# EAGLE design Recuperaçao e Paraquedas (EAGLE 9.6.2)

## Sheet 1 of 4: Microcontrolador recuperação
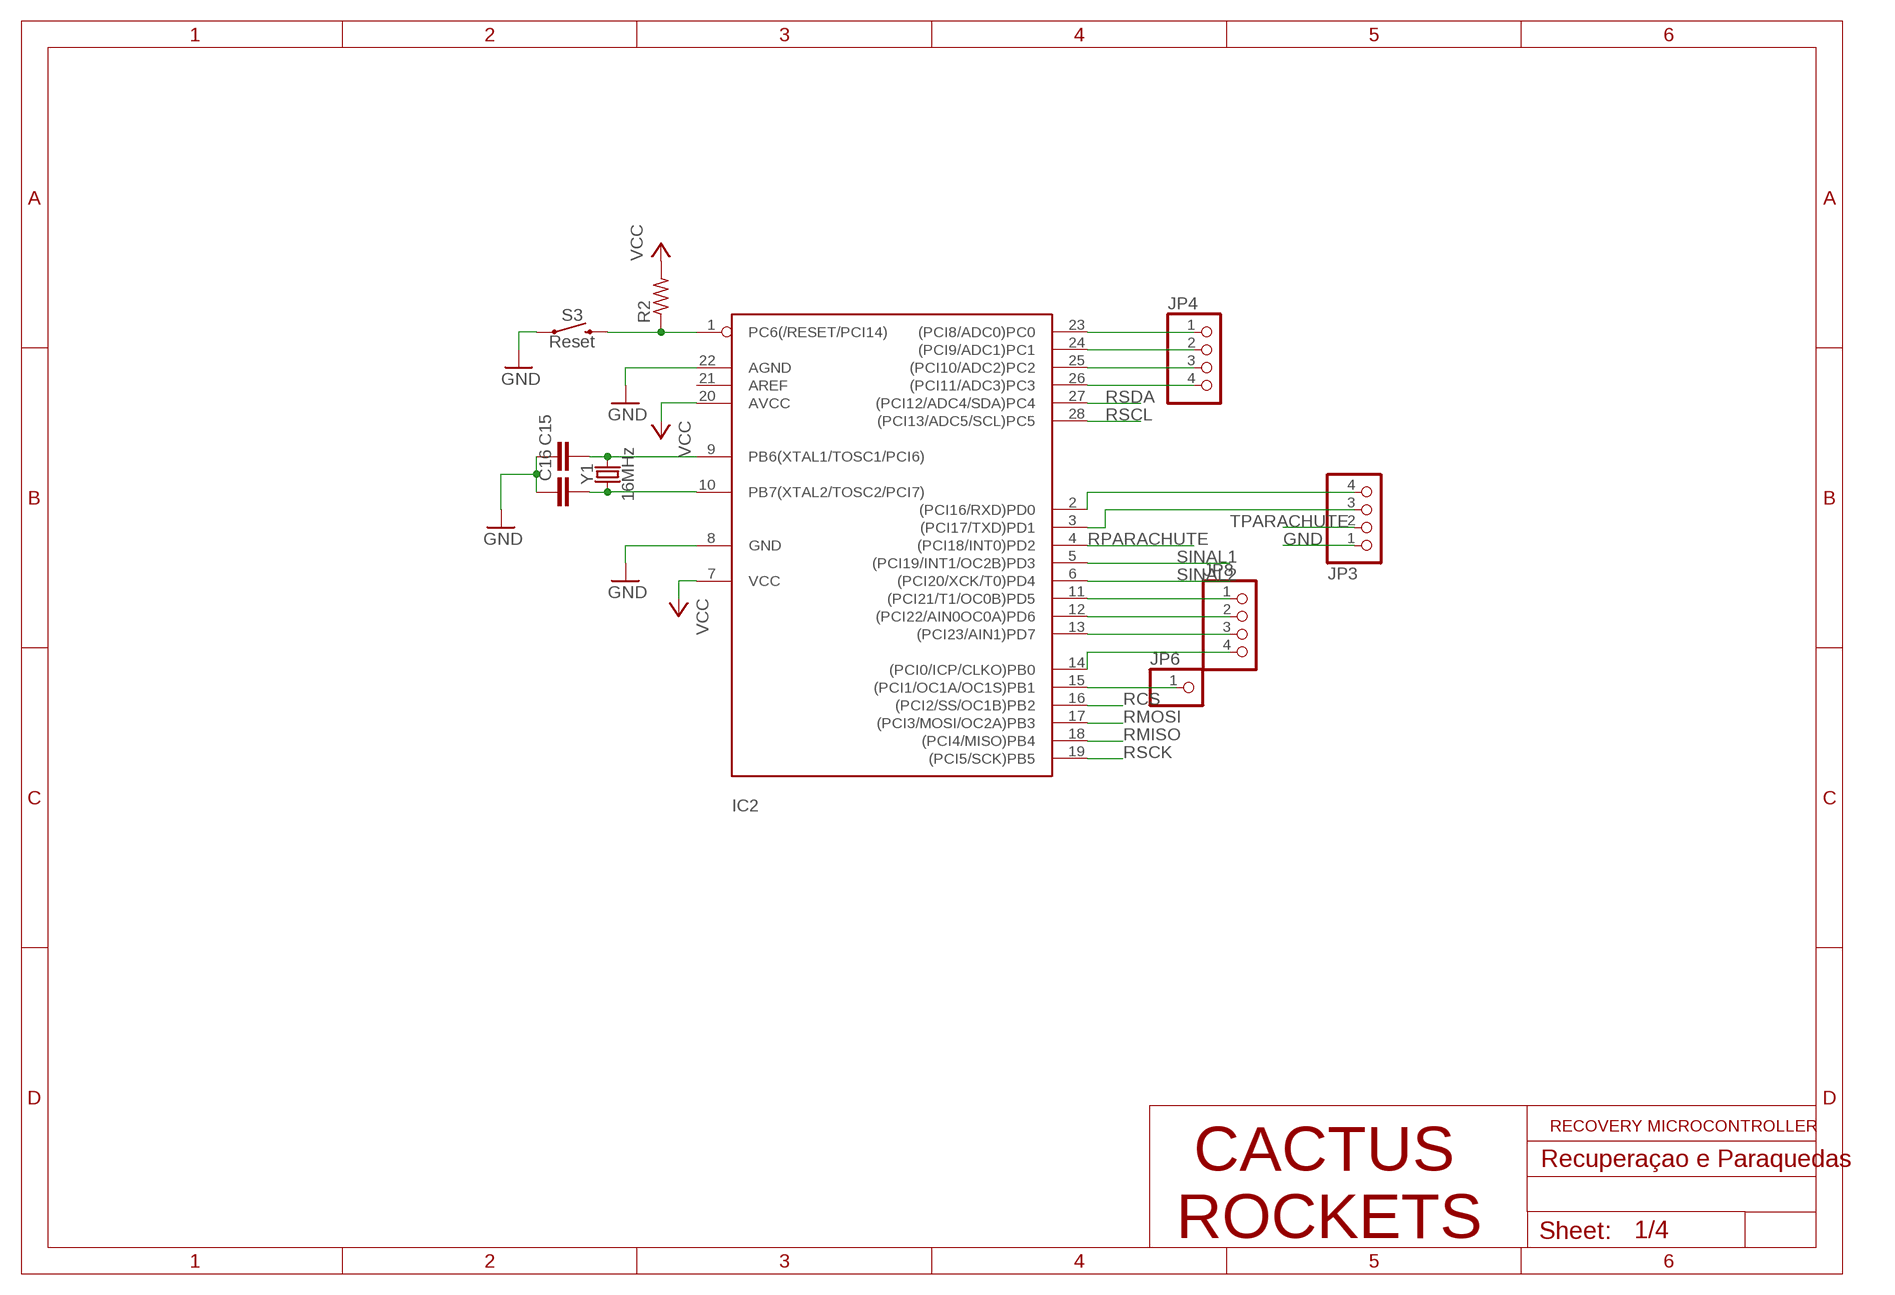
[diagram p0: schematic, sheet 1]

### Parts
C15  C-EU025-025X050  [C025-025X050]
C16  C-EU025-025X050  [C025-025X050]
IC2  ATMEGA328-20P  [DIL28-3]
JP3  PINHD-1X4/90  [1X04/90]
JP4  PINHD-1X4  [1X04]
JP6  PINHD-1X1  [1X01]
JP8  PINHD-1X4  [1X04]
R2  R-US_0207/10  [0207/10]
S3  Reset  MOMENTARY-SWITCH-SPST-PTH-6.0MM  [TACTILE_SWITCH_PTH_6.0MM]
Y1  16MHz  CRYSTAL-16MHZPTH-HC49US  [HC49US]

### Nets
GND: C15.1 C16.1 IC2.8(GND) IC2.22(AGND) JP3.1 S3.1 S3.2 ; also sheet 2,3,4
N$1: IC2.23((PCI8/ADC0)PC0) JP4.1
N$2: IC2.24((PCI9/ADC1)PC1) JP4.2
N$3: IC2.25((PCI10/ADC2)PC2) JP4.3
N$4: IC2.26((PCI11/ADC3)PC3) JP4.4
N$5: IC2.2((PCI16/RXD)PD0) JP3.4
N$8: IC2.11((PCI21/T1/OC0B)PD5) JP8.1
N$9: IC2.12((PCI22/AIN0OC0A)PD6) JP8.2
N$10: IC2.13((PCI23/AIN1)PD7) JP8.3
N$11: IC2.15((PCI1/OC1A/OC1S)PB1) JP6.1
N$12: IC2.14((PCI0/ICP/CLKO)PB0) JP8.4
N$13: C16.2 IC2.10(PB7(XTAL2/TOSC2/PCI7)) Y1.1
N$14: C15.2 IC2.9(PB6(XTAL1/TOSC1/PCI6)) Y1.2
N$15: IC2.3((PCI17/TXD)PD1) JP3.3
RCS: IC2.16((PCI2/SS/OC1B)PB2) ; also sheet 3
RESET: IC2.1(PC6(/RESET/PCI14)) R2.1 S3.3 S3.4
RMISO: IC2.18((PCI4/MISO)PB4) ; also sheet 3
RMOSI: IC2.17((PCI3/MOSI/OC2A)PB3) ; also sheet 3
RPARACHUTE: IC2.4((PCI18/INT0)PD2) ; also sheet 4
RSCK: IC2.19((PCI5/SCK)PB5) ; also sheet 3
RSCL: IC2.28((PCI13/ADC5/SCL)PC5) ; also sheet 2
RSDA: IC2.27((PCI12/ADC4/SDA)PC4) ; also sheet 2
SINAL1: IC2.5((PCI19/INT1/OC2B)PD3) ; also sheet 4
SINAL2: IC2.6((PCI20/XCK/T0)PD4) ; also sheet 4
TPARACHUTE: JP3.2 ; also sheet 4
VCC: IC2.7(VCC) IC2.20(AVCC) R2.2 ; also sheet 2,3,4
Unconnected: IC2.21(AREF)

### Notes on the sheet
- RECOVERY MICROCONTROLLER
- CACTUS
  ROCKETS

## Sheet 2 of 4: MPU-6050
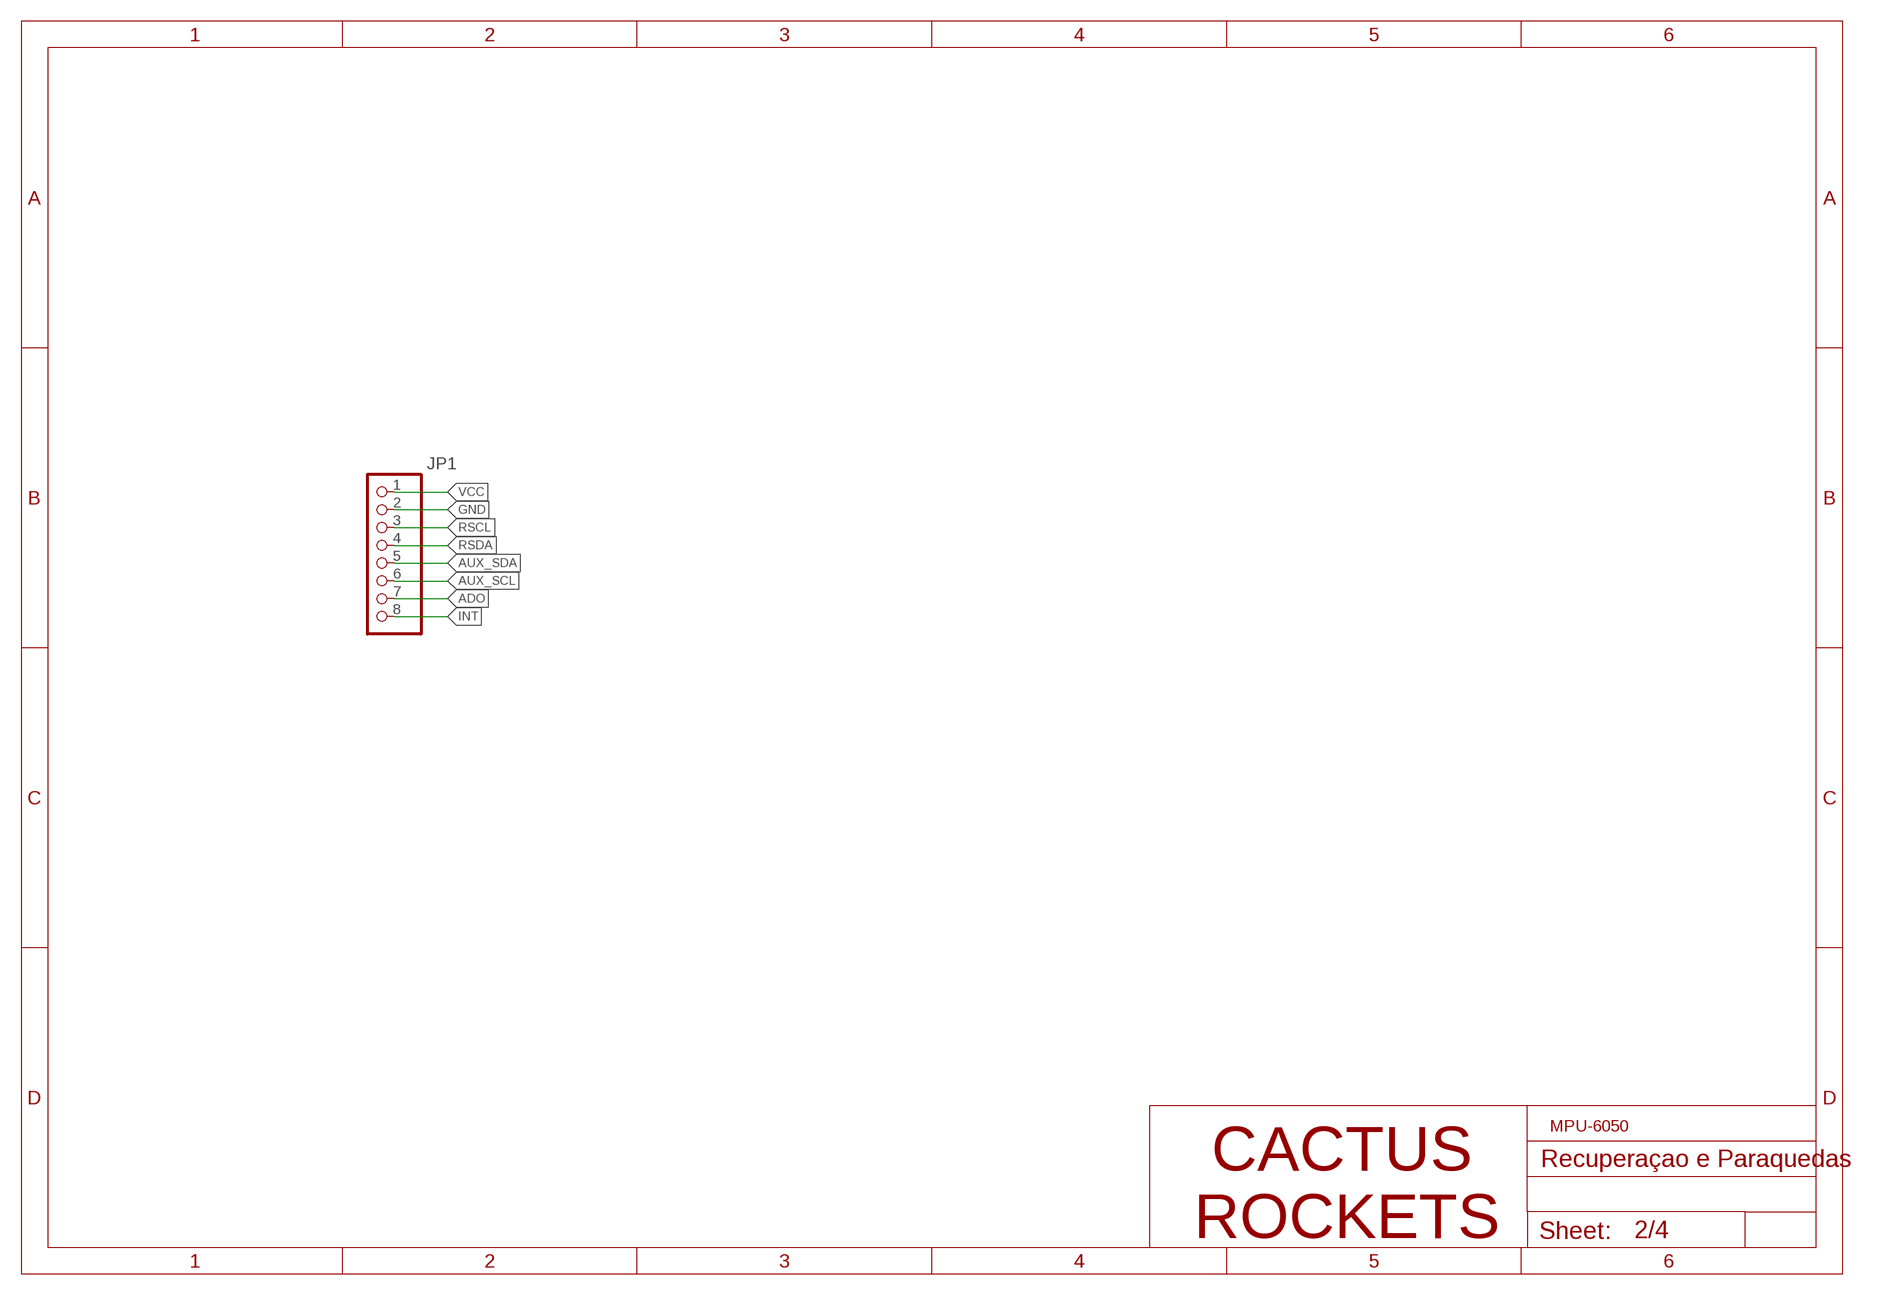
[diagram p1: schematic, sheet 2]

### Parts
JP1  PINHD-1X8  [1X08]

### Nets
ADO: JP1.7
AUX_SCL: JP1.6
AUX_SDA: JP1.5
GND: JP1.2 ; also sheet 1,3,4
INT: JP1.8
RSCL: JP1.3 ; also sheet 1
RSDA: JP1.4 ; also sheet 1
VCC: JP1.1 ; also sheet 1,3,4

### Notes on the sheet
- MPU-6050
- CACTUS
  ROCKETS

## Sheet 3 of 4: BMP280
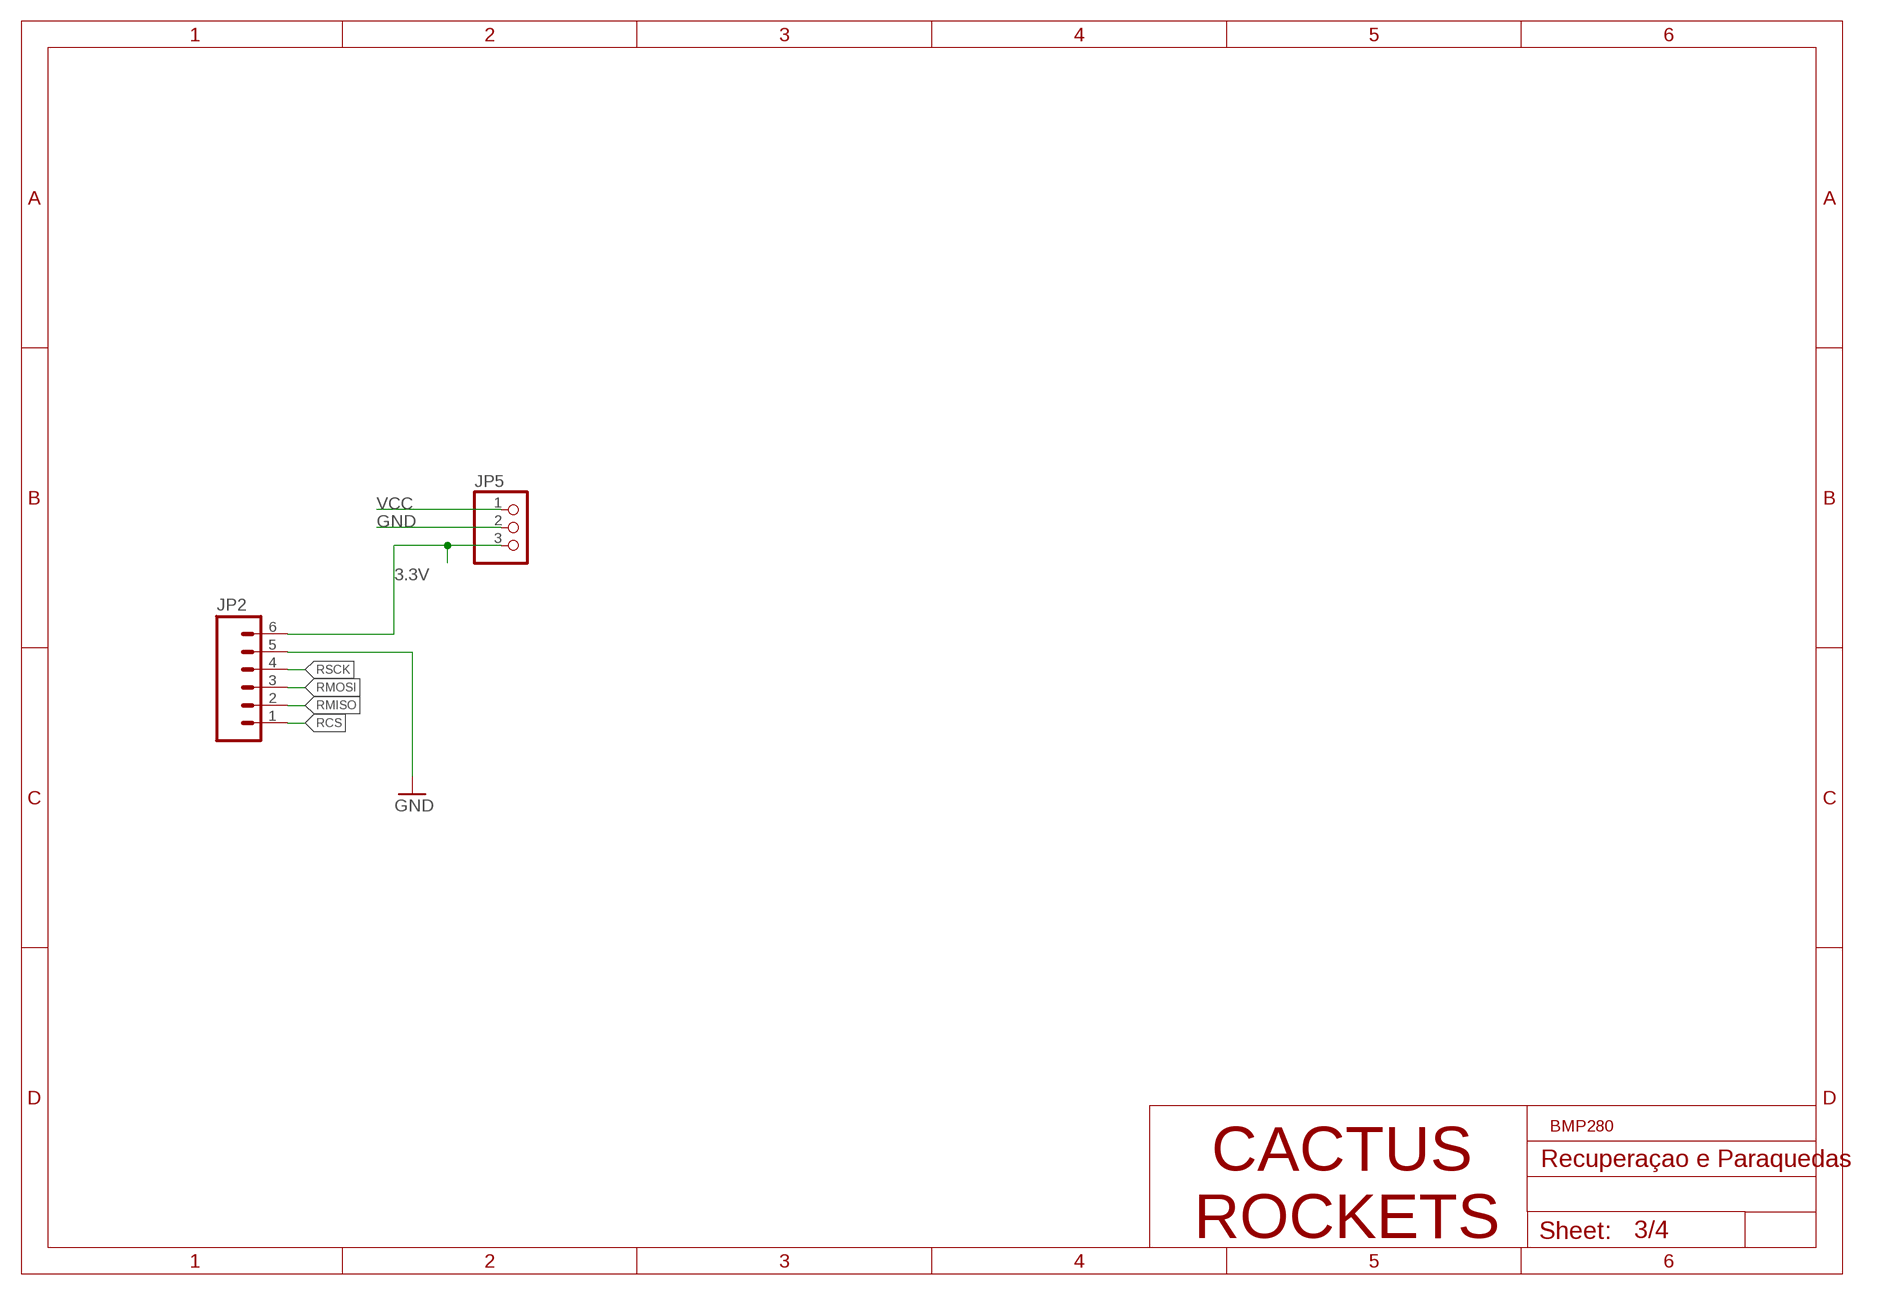
[diagram p2: schematic, sheet 3]

### Parts
JP2  M06NO_SILK_FEMALE_PTH  [1X06_NO_SILK]
JP5  PINHD-1X3/90  [1X03/90]

### Nets
3.3V: JP2.6 JP5.3
GND: JP2.5 JP5.2 ; also sheet 1,2,4
RCS: JP2.1 ; also sheet 1
RMISO: JP2.2 ; also sheet 1
RMOSI: JP2.3 ; also sheet 1
RSCK: JP2.4 ; also sheet 1
VCC: JP5.1 ; also sheet 1,2,4

### Notes on the sheet
- BMP280
- CACTUS
  ROCKETS

## Sheet 4 of 4
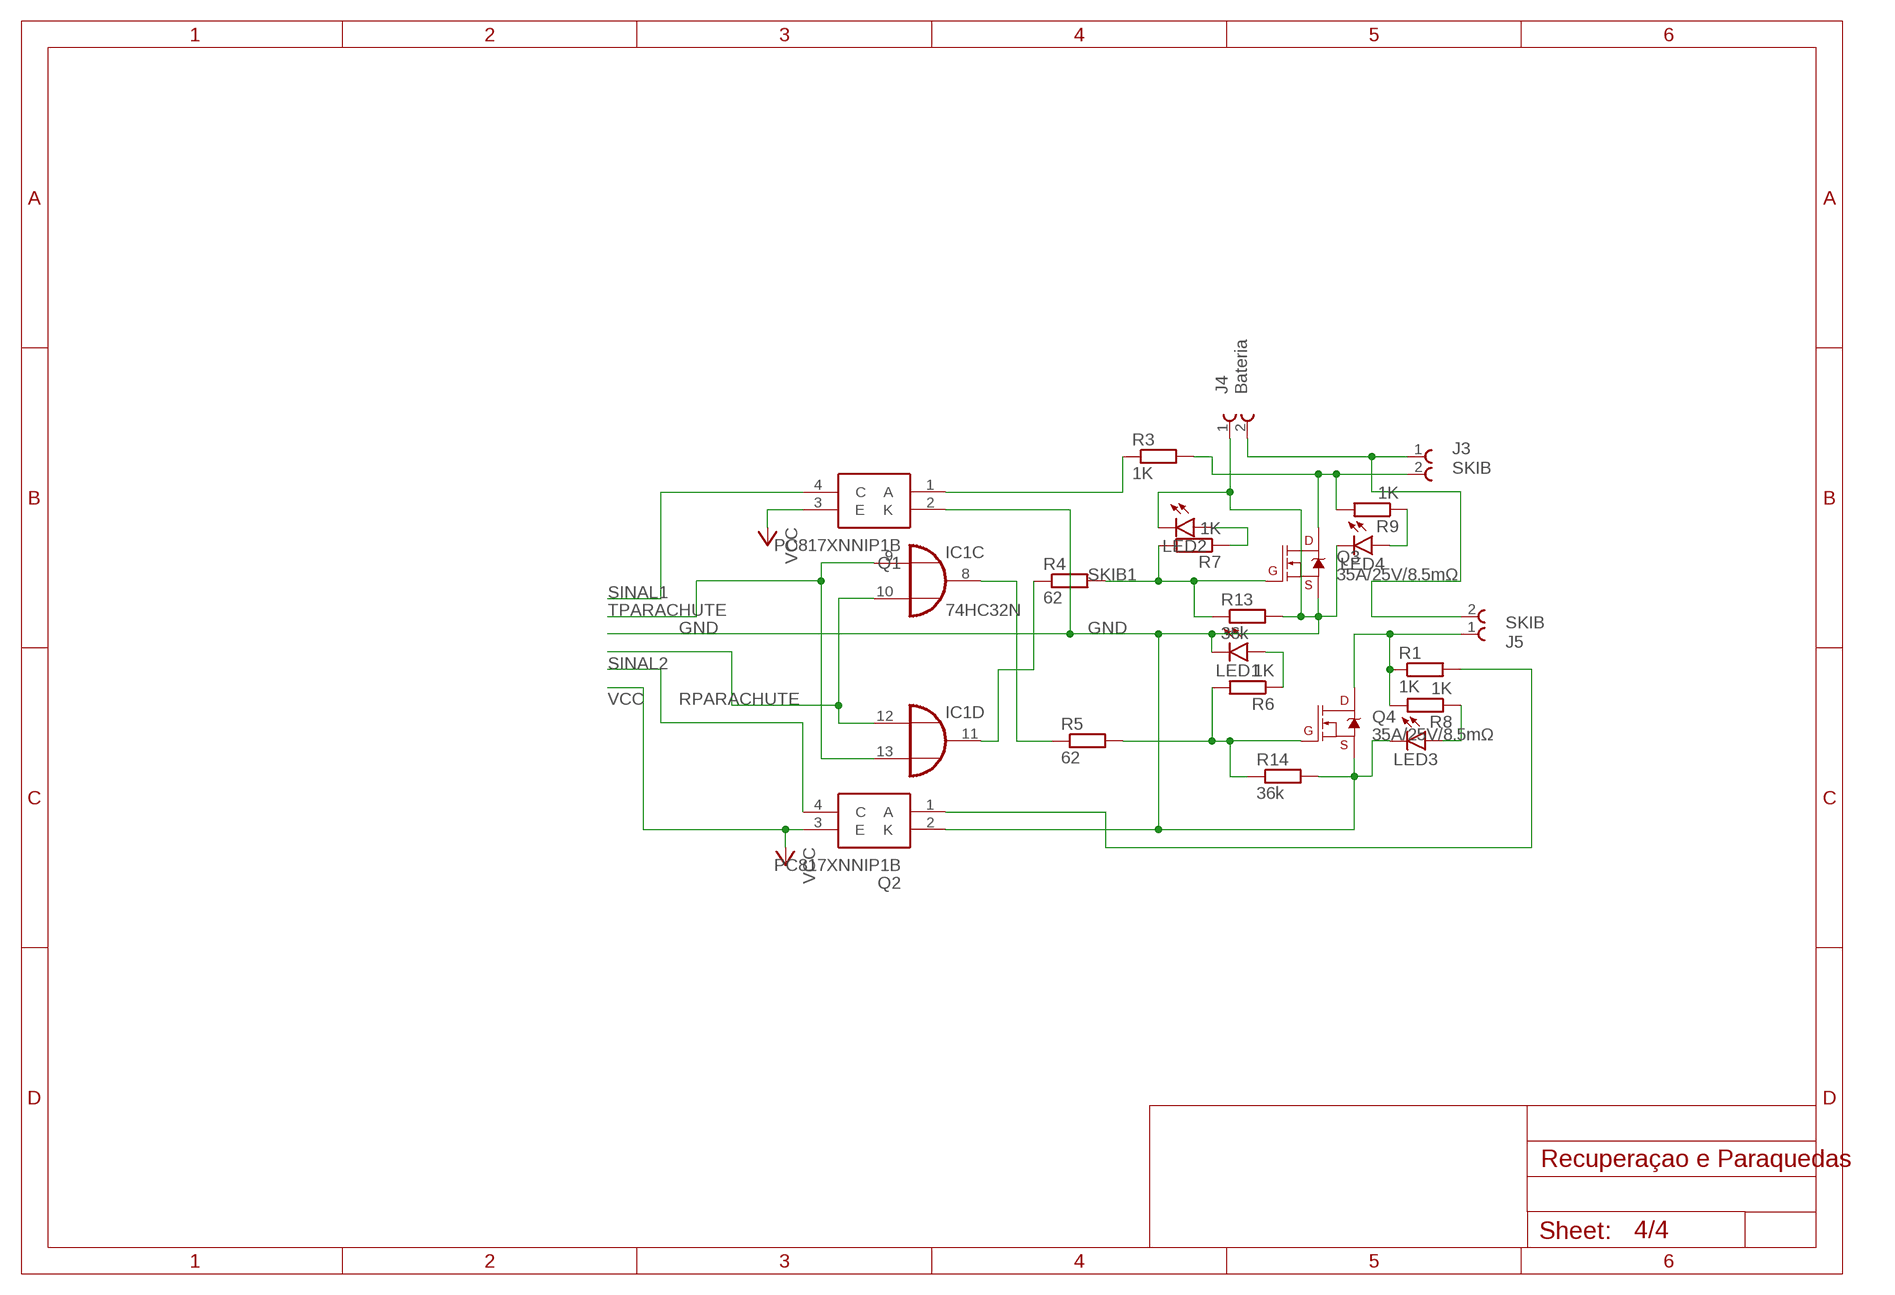
[diagram p3: schematic, sheet 4]

### Parts
IC1  74HC32N  [DIL14]
J3  SKIB  691111710002  [691111710002]
J4  Bateria  691111710002  [691111710002]
J5  SKIB  691111710002  [691111710002]
LED1  LEDCHIP-LED0805  [CHIP-LED0805]
LED2  LEDCHIP-LED0805  [CHIP-LED0805]
LED3  LEDCHIP-LED0805  [CHIP-LED0805]
LED4  LEDCHIP-LED0805  [CHIP-LED0805]
Q1  PC817XNNIP1B  [SOP254P960X420-4N]
Q2  PC817XNNIP1B  [SOP254P960X420-4N]
Q3  35A/25V/8.5mΩ  MOSFET-NCH-FDD8780  [TO-252/DPAK]
Q4  35A/25V/8.5mΩ  MOSFET-NCH-FDD8780  [TO-252/DPAK]
R1  1K  R-EU_R0603  [R0603]
R3  1K  R-EU_R0603  [R0603]
R4  62  R-EU_M0805  [M0805]
R5  62  R-EU_M0805  [M0805]
R6  1K  R-EU_M0805  [M0805]
R7  1K  R-EU_M0805  [M0805]
R8  1K  R-EU_M0805  [M0805]
R9  1K  R-EU_M0805  [M0805]
R13  36k  R-EU_M0805  [M0805]
R14  36k  R-EU_M0805  [M0805]

### Nets
GND: J4.1 LED1.C LED2.C LED3.C LED4.C Q1.2(K) Q2.2(K) Q3.3(S) Q4.3(S) R13.2 R14.2 ; also sheet 1,2,3
N$6: IC1.8(C:O) R5.1
N$7: IC1.11(D:O) R4.1
N$17: Q1.1(A) R3.1
N$19: LED4.A R9.1
N$20: Q2.1(A) R1.2
N$21: J3.1 J4.2 J5.2
N$22: LED2.A R7.1
N$23: LED1.A R6.1
N$24: LED3.A R8.1
N$25: J5.1 Q4.2(D) R1.1 R8.2
N$29: J3.2 Q3.2(D) R3.2 R9.2
RPARACHUTE: IC1.10(C:I1) IC1.12(D:I0) ; also sheet 1
SINAL1: Q1.4(C) ; also sheet 1
SINAL2: Q2.4(C) ; also sheet 1
SKIB1: Q3.1(G) R4.2 R7.2 R13.1
SKIB2: Q4.1(G) R5.2 R6.2 R14.1
TPARACHUTE: IC1.9(C:I0) IC1.13(D:I1) ; also sheet 1
VCC: Q1.3(E) Q2.3(E) ; also sheet 1,2,3
Unconnected: IC1.1(A:I0) IC1.2(A:I1) IC1.3(A:O) IC1.4(B:I0) IC1.5(B:I1) IC1.6(B:O)

## Power pins joined to a net without a drawn wire
GND: IC1.7(P:GND)
VCC: IC1.14(P:VCC)

## Library data of the parts
C15 C16 = rcl:C-EU: CAPACITOR, European symbol; SPICEPREFIX: C
IC1 = 74xx-eu:74*32: Quad 2-input OR gate
IC2 = atmega328:ATMEGA328*P: MICROCONTROLLER 32 kBytes FLASH 2 kBytes SRAM 1 kBytes EEPROM USART 8-channel 10 bit ADC
J3-J5 = 691111710002:691111710002: WR-TBL Serie 111 - 5.0mm Horizontal Entry Modular With Pressure Clamp - 2.0mm2 Wires, 2 Pins=>Code : Con_TBL_Screw_PressureClamp_691111710002 <http://katalog.we-online.de/media/images/eican/Con_TBL_Screw_PressureClamp_6911117100xx_pf2.jpg> Details see: http://katalog.we-online.de/en/em/691_111_710_0xx Created 2014-06-17, Karrer Zheng 2014 (C) Würth Elektronik Check availability <https://pricing.snapeda.com/parts/691111710002/Wurth%20Electronics/view-part?ref=eda>; AVAILABILITY: In Stock; DESCRIPTION: 2 Position Wire to Board Terminal Block Horizontal with Board 0.197 (5.00mm) Through Hole; MF: Wurth Electronics; MP: 691111710002; PACKAGE: None; PRICE: None; PURCHASE-URL: https://pricing.snapeda.com/search/part/691111710002/?ref=eda
JP1 = pinhead:PINHD-1X8: PIN HEADER
JP2 = SparkFun-Connectors:M06: Header 6 Standard 6-pin 0.1" header. Use with straight break away headers (SKU : PRT-00116), right angle break away headers (PRT-00553), swiss pins (PRT-00743), machine pins (PRT-00117), and female headers (PRT-00115). Molex polarized connector foot print use with SKU : PRT-08094 with associated crimp pins and housings. NOTES ON THE VARIANTS LOCK and LOCK_LONGPADS... This footprint was designed to help hold the alignment of a through-hole component (i.e. 6-pin header) while soldering it into place. You may notice that each hole has been shifted either up or down by 0.005 of an inch from it's more standard position (which is a perfectly straight line). This slight alteration caused the pins (the squares in the middle) to touch the edges of the holes. Because they are alternating, it causes a "brace" to hold the component in place. 0.005 has proven to be the perfect amount of "off-center" position when using our standard breakaway headers. Although looks a little odd when you look at the bare footprint, once you have a header in there, the alteration is very hard to notice. Also,if you push a header all the way into place, it is covered up entirely on the bottom side. This idea of altering the position of holes to aid alignment will be further integrated into the Sparkfun Library for other footprints. It can help hold any component with 3 or more connection pins.; PROD_ID: CONN-08437
JP3 JP4 JP8 = pinhead:PINHD-1X4: PIN HEADER
JP5 = pinhead:PINHD-1X3: PIN HEADER
JP6 = pinhead:PINHD-1X1: PIN HEADER
LED1-LED4 = led:LED: LED OSRAM: - CHIPLED LG R971, LG N971, LY N971, LG Q971, LY Q971, LO R971, LY R971 LH N974, LH R974 LS Q976, LO Q976, LY Q976 LO Q996 - Hyper CHIPLED LW Q18S LB Q993, LB Q99A, LB R99A - SideLED LS A670, LO A670, LY A670, LG A670, LP A670 LB A673, LV A673, LT A673, LW A673 LH A674 LY A675 LS A676, LA A676, LO A676, LY A676, LW A676 LS A679, LY A679, LG A679 - Hyper Micro SIDELED® LS Y876, LA Y876, LO Y876, LY Y876 LT Y87S - SmartLED LW L88C, LW L88S LB L89C, LB L89S, LG L890 LS L89K, LO L89K, LY L89K LS L896, LA L896, LO L896, LY L896 - TOPLED LS T670, LO T670, LY T670, LG T670, LP T670 LSG T670, LSP T670, LSY T670, LOP T670, LYG T670 LG T671, LOG T671, LSG T671 LB T673, LV T673, LT T673, LW T673 LH T674 LS T676, LA T676, LO T676, LY T676, LB T676, LH T676, LSB T676, LW T676 LB T67C, LV T67C, LT T67C, LS T67K, LO T67K, LY T67K, LW E67C LS E67B, LA E67B, LO E67B, LY E67B, LB E67C, LV E67C, LT E67C LW T67C LS T679, LY T679, LG T679 LS T770, LO T770, LY T770, LG T770, LP T770 LB T773, LV T773, LT T773, LW T773 LH T774 LS E675, LA E675, LY E675, LS T675 LS T776, LA T776, LO T776, LY T776, LB T776 LHGB T686 LT T68C, LB T68C - Hyper Mini TOPLED® LB M676 - Mini TOPLED Santana® LG M470 LS M47K, LO M47K, LY M47K Source: http://www.osram.convergy.de LUXEON: - LUMILED® LXK2-PW12-R00, LXK2-PW12-S00, LXK2-PW14-U00, LXK2-PW14-V00 LXK2-PM12-R00, LXK2-PM12-S00, LXK2-PM14-U00 LXK2-PE12-Q00, LXK2-PE12-R00, LXK2-PE12-S00, LXK2-PE14-T00, LXK2-PE14-U00 LXK2-PB12-K00, LXK2-PB12-L00, LXK2-PB12-M00, LXK2-PB14-N00, LXK2-PB14-P00, LXK2-PB14-Q00 LXK2-PR12-L00, LXK2-PR12-M00, LXK2-PR14-Q00, LXK2-PR14-R00 LXK2-PD12-Q00, LXK2-PD12-R00, LXK2-PD12-S00 LXK2-PH12-R00, LXK2-PH12-S00 LXK2-PL12-P00, LXK2-PL12-Q00, LXK2-PL12-R00 Source: www.luxeon.com KINGBRIGHT: KA-3528ASYC Source: www.kingbright.com
Q1 Q2 = SamacSys_Parts:PC817XNNIP1B: Transistor Output Optocouplers Photocoupler Source: Datasheet; DESCRIPTION: Transistor Output Optocouplers Photocoupler; HEIGHT: 4.2mm; MANUFACTURER_NAME: Sharp Microelectronics; MANUFACTURER_PART_NUMBER: PC817XNNIP1B; MOUSER_PART_NUMBER: 852-PC817XNNIP1B; MOUSER_PRICE-STOCK: https://www.mouser.co.uk/ProductDetail/Sharp-Microelectronics/PC817XNNIP1B?qs=rrS6PyfT74dJvnx7366b6Q%3D%3D
Q3 Q4 = SparkFun-DiscreteSemi:MOSFET-NCH: N-channel MOSFETs Voltage controlled devices that allow control of high current outputs. SparkFun Products: SparkFun OpenScale <https://www.sparkfun.com/products/13261> SparkFun Digital Sandbox <https://www.sparkfun.com/products/12651> SparkFun Monster Moto Shield <https://www.sparkfun.com/products/10182> SparkFun MOSFET Power Controller <https://www.sparkfun.com/products/11214>; PROD_ID: TRANS-09984
R1 R3-R9 R13 R14 = rcl:R-EU_: RESISTOR, European symbol; SPICEPREFIX: R
R2 = rcl:R-US_: RESISTOR, American symbol; SPICEPREFIX: R
S3 = SparkFun-Switches:MOMENTARY-SWITCH-SPST: Momentary Switch (Pushbutton) - SPST Normally-open (NO) SPST momentary switches (buttons, pushbuttons). Variants PTH-12MM - 12mm square, through-hole Momentary Pushbutton Switch - 12mm Square <https://www.sparkfun.com/products/9190> (COM-09190) PTH-6.0MM, PTH-6.0MM-KIT - 6.0mm square, through-hole Mini Pushbutton Switch <https://www.sparkfun.com/products/97> (COM-00097) KIT package intended for soldering kit's - only one side of pads' copper is exposed. PTH-RIGHT-ANGLE-KIT - Right-angle, through-hole Right Angle Tactile Button <https://www.sparkfun.com/products/10791> - Used on SparkFun BigTime Watch Kit <https://www.sparkfun.com/products/11734> SMD-12MM - 12mm square, surface-mount Tactile Button - SMD (12mm) <https://www.sparkfun.com/products/12993> (COM-12993) Used on SparkFun PicoBoard <https://www.sparkfun.com/products/11888> SMD-4.5MM - 4.5mm Square Trackball Switch Used on SparkFun Blackberry Trackballer Breakout <https://www.sparkfun.com/products/13169> SMD-4.6MMX2.8MM - 4.60mm x 2.80mm, surface mount Used on SparkFun Pro Micro - RP2040 <https://www.sparkfun.com/products/17717> SMD-5.2MM, SMD-5.2-REDUNDANT - 5.2mm square, surface-mount Mini Pushbutton Switch - SMD <https://www.sparkfun.com/products/8720> (COM-08720) Used on Arduino Pro Mini <https://www.sparkfun.com/products/11114> REDUNDANT package connects both switch circuits together SMD-6.0X3.5MM - 6.0 x 3.5mm, surface mount Momentary Reset Switch SMD <https://www.sparkfun.com/products/8229> (COM-08229) SMD-6.2MM-TALL - 6.2mm square, surface mount Tactile Button - SMD (6mm) <https://www.sparkfun.com/products/12992> Used on SparkFun Digital Sandbox <https://www.sparkfun.com/products/12651> SMD-RIGHT-ANGLE - Right-angle, surface mount Used on SparkFun Block for Intel® Edison - Arduino <https://www.sparkfun.com/products/13036>; PROD_ID: SWCH-08441; SF_SKU: COM-00097
Y1 = SparkFun-Clocks:CRYSTAL-16MHZ: 16MHz Crystal Digikey Example <http://www.digikey.com/product-search/en?keywords=535-9122-1-ND> Frequency: 16MHz Frequency Stability: ±50ppm Frequency Tolerance: ±20ppm Load Capacitance: 18pF SparkFun Products: Pro Micro -5V/16MHz <https://www.sparkfun.com/products/12640> SparkFun Serial Enabled LCD Kit <https://www.sparkfun.com/products/10097>; PROD_ID: XTAL-08181; SF_ID: COM-00536

## Board
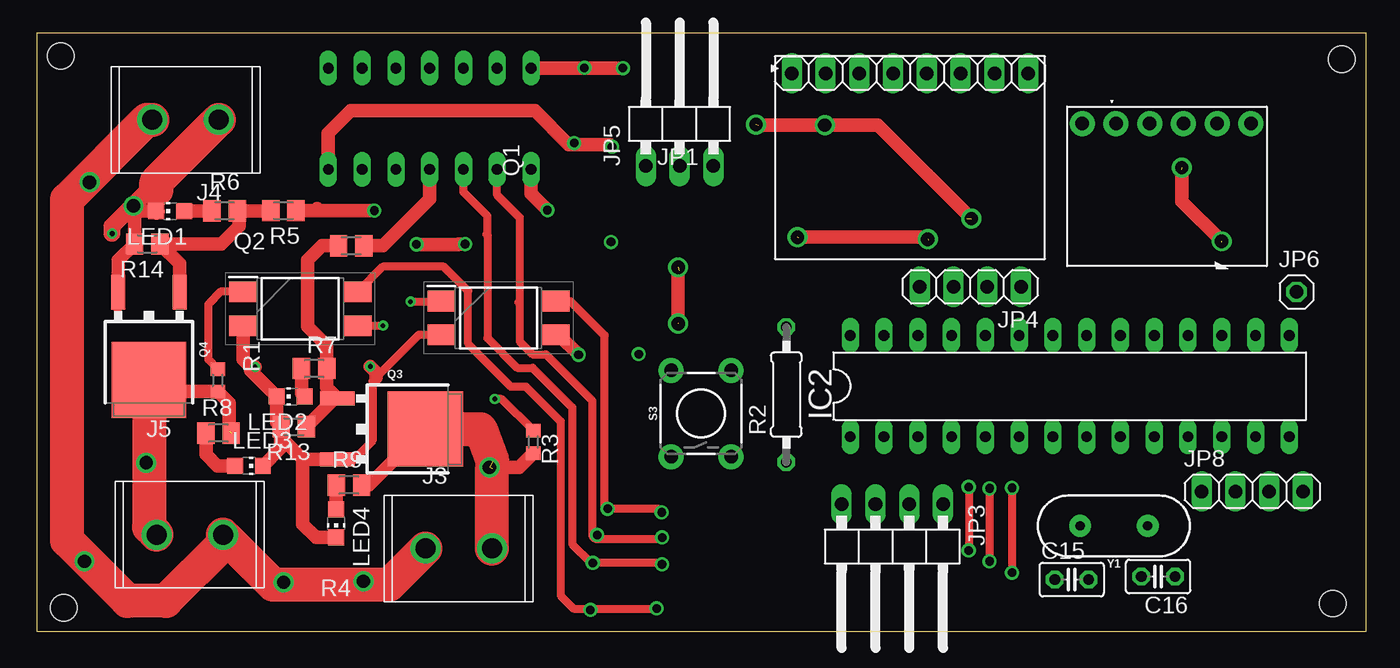
[diagram p4: board, top side]
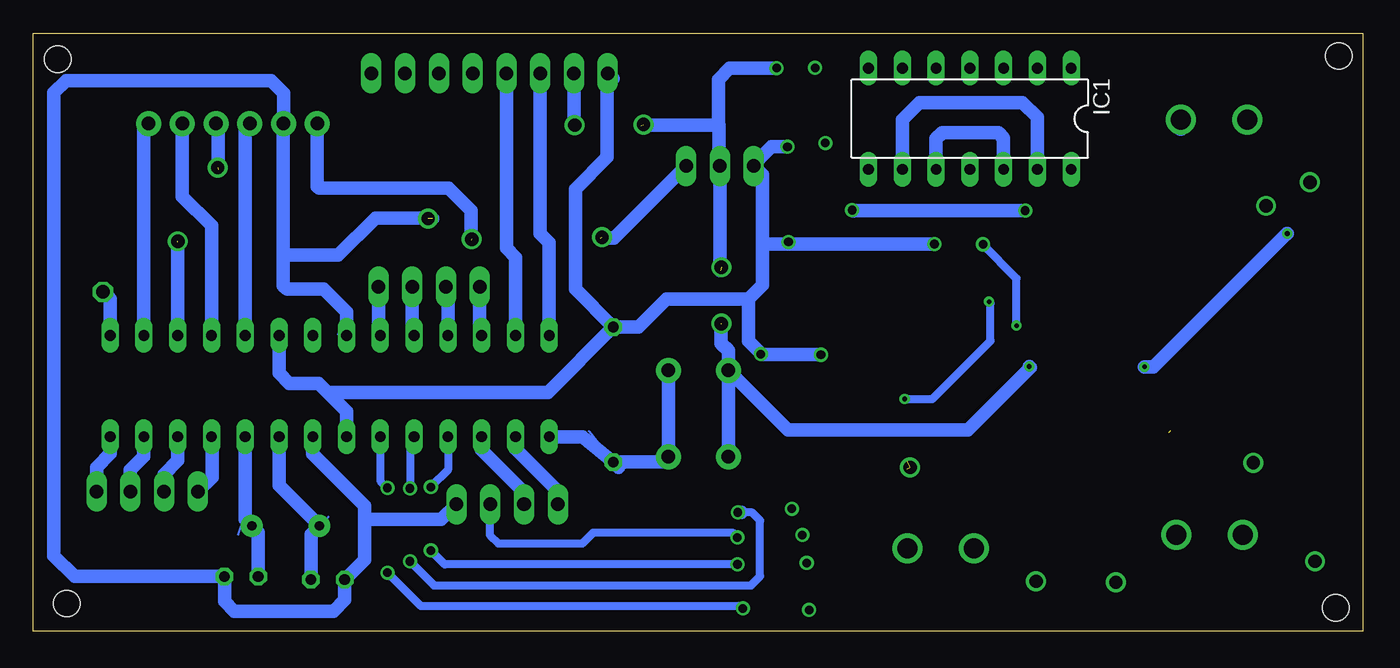
[diagram p5: board, bottom side, seen from below]

Size 100 x 45 mm. Coordinates in mm from the lower left corner, seen from the top.
Outline: 0,0 100,0 100,45 0,45 0,0
Copper layers (1*16): Top 0.035mm / dielectric 1.5mm / Bottom 0.035mm
Design rules "default": minimum track width 6mil, minimum drill 0.35mm, track to track 6mil, track to pad 6mil, pad to pad 6mil, via to via 6mil, smd to smd 6mil, copper to edge 40mil, drill to drill 6mil, minimum pad ring 10mil, minimum via ring 8mil, stop-mask expansion 4mil, vias tented up to drill 0mil, thermal gap 10mil
Holes 2 mm at 1.82,43.29 2.05,1.76 97.48,2.09 98.16,43.06

### Footprints (pad centres in the part's own frame; a part is rotated, then mirrored left to right if it is on the bottom)
C025-025X050 = drill 0.813 octagon: 1 -1.27,0; 2 1.27,0
DIL14 = drill 0.813 long: 1 -7.62,-3.81; 2 -5.08,-3.81; 3 -2.54,-3.81; 4 0,-3.81; 5 2.54,-3.81; 6 5.08,-3.81; 7 7.62,-3.81; 8 7.62,3.81; 9 5.08,3.81; 10 2.54,3.81; 11 0,3.81; 12 -2.54,3.81; 13 -5.08,3.81; 14 -7.62,3.81
DIL28-3 = drill 0.813 long: 1 -16.51,-3.81; 2 -13.97,-3.81; 3 -11.43,-3.81; 4 -8.89,-3.81; 5 -6.35,-3.81; 6 -3.81,-3.81; 7 -1.27,-3.81; 8 1.27,-3.81; 9 3.81,-3.81; 10 6.35,-3.81; 11 8.89,-3.81; 12 11.43,-3.81; 13 13.97,-3.81; 14 16.51,-3.81; 15 16.51,3.81; 16 13.97,3.81; 17 11.43,3.81; 18 8.89,3.81; 19 6.35,3.81; 20 3.81,3.81; 21 1.27,3.81; 22 -1.27,3.81; 23 -3.81,3.81; 24 -6.35,3.81; 25 -8.89,3.81; 26 -11.43,3.81; 27 -13.97,3.81; 28 -16.51,3.81
691111710002 = drill 1.5: 1 -2.5,0; 2 2.5,0
1X08 = drill 1.016 long: 1 -8.89,0; 2 -6.35,0; 3 -3.81,0; 4 -1.27,0; 5 1.27,0; 6 3.81,0; 7 6.35,0; 8 8.89,0
1X06_NO_SILK = drill 1.016 pad 1.88: 1 0,0; 2 2.54,0; 3 5.08,0; 4 7.62,0; 5 10.16,0; 6 12.7,0
1X04/90 = drill 1.016 long: 1 -3.81,-3.81; 2 -1.27,-3.81; 3 1.27,-3.81; 4 3.81,-3.81
1X04 = drill 1.016 long: 1 -3.81,0; 2 -1.27,0; 3 1.27,0; 4 3.81,0
1X03/90 = drill 1.016 long: 1 -2.54,-3.81; 2 0,-3.81; 3 2.54,-3.81
1X01 = drill 1.016 octagon: 1 0,0
CHIP-LED0805 = smd 1.2 x 1.2: A 0,-1.05; C 0,1.05
SOP254P960X420-4N = smd 2.1 x 1.55: 1 -4.3,1.27; 2 -4.3,-1.27; 3 4.3,-1.27; 4 4.3,1.27
TO-252/DPAK = smd 1.06 x 2.6: 1 -2.3,-4.31; 3 2.3,-4.31 | smd 5.632 x 5.7: 2 0,2.288
R0603 = smd 1 x 1.1: 1 -0.85,0; 2 0.85,0
0207/10 = drill 0.813 octagon: 1 -5.08,0; 2 5.08,0
M0805 = smd 1.3 x 1.6: 1 -0.95,0; 2 0.95,0
TACTILE_SWITCH_PTH_6.0MM = drill 1.016 pad 1.88: 1 -3.251,2.261; 2 3.251,2.261; 3 -3.251,-2.261; 4 3.251,-2.261
HC49US = drill 0.7 pad 1.651: 1 -2.54,0; 2 2.54,0

### Placement (x,y rotation side)
C15  77.84,3.89 0 top
C16  84.35,4.12 180 top
IC1  29.56,38.57 180 bottom
IC2  77.7,18.45 0 top
J3  31.74,6.23 0 top
J4  11.19,38.49 180 top
J5  11.52,7.27 0 top
JP1  65.68,41.99 0 top
JP2  91.33,38.2 180 top
JP3  64.36,5.75 180 top
JP4  70.22,25.92 180 top
JP5  48.35,38.82 0 top
JP6  94.76,25.54 0 top
JP8  91.43,10.52 0 top
LED1  10.05,31.61 90 top
LED2  19.12,17.66 90 top
LED3  15.97,12.45 270 top
LED4  22.52,8.11 180 top
Q1  34.74,23.58 0 top
Q2  19.83,24.27 0 top
Q3  26.94,15.22 270 top
Q4  8.45,21.19 180 top
R1  13.63,18.88 90 top
R2  56.38,17.81 90 top
R3  37.36,14.26 270 top
R4  23.67,29.01 180 top
R5  18.56,31.66 180 top
R6  14.14,31.63 0 top
R7  20.87,19.77 0 top
R8  13.68,14.92 0 top
R9  23.49,11.01 0 top
R13  19.35,15.4 180 top
R14  8.32,29.14 180 top
S3  49.98,16.39 90 top
Y1  81.02,7.93 180 top

### Tracks (layer width: path | path; a pad name or v marks a point on that pad's centre or on a via)
3.3V  (via drill 1)  (2 unrouted)
  Top 1.016: v57.22,29.65 66.87,29.65 v67.02,29.5
  Bottom 1.016: JP5.3 56.3,29.6 57.32,29.6 | JP2.6 78.63,33.46 78.5,33.33 68.75,33.33 67.07,31.66 67.07,29.42
GND  (via drill 0.35, 0.65, 1)  (4 unrouted)
  Top 0.61: 7.37,29.69 R14.2 | 6.06,24.24 6.06,25.41 Q4.3 | Q3.3 22.72,12.84 23.77,12.84 25.27,14.33 25.27,18.02 25.27,18.83 25.55,19.11 28.75,22.31 Q1.2
  Top 1.016: Q4.3 6.15,27.92 R14.2 7.37,32.17 7.94,31.61 LED1.C | 59.43,41.9 JP1.2 | Q3.3 20.05,12.92 | 20.05,12.92 18.36,14.61 | 18.36,14.61 18.36,15.36 R13.2 18.07,15.73 LED2.C 16.1,19.63 16.1,19.9 | LED4.C 21.01,7.06 20.01,8.06 20.01,12.88 20.05,12.92 | LED3.C 18.36,13.79 18.36,14.61 | IC1.7 v44.09,42.38 44.11,42.35 | Q2.2 15.53,20.46 16.1,19.9 | 16.1,19.9 v16.43,19.9 | v70.3,31.05 63.26,38.08 v59.28,38.08 54.15,38.08 v54.09,38.13 | v48.25,27.39 v48.25,23.15 | v25.09,19.92 25.55,19.46 25.55,19.11
  Top 1.27: LED1.C 9,33.22 8.43,33.22 7.37,32.17 5.68,30.48 v5.68,29.93
  Top 2.54: 9,33.22 9,33.8 J4.1
  Bottom 0.152: 68.24,9.51 JP3.1 | 77.11,22.36 76.5,22.36 76.46,22.3 IC2.22 | 59.43,41.87 59.34,41.98 JP1.2 | 81.22,38.06 81.21,38.08 JP2.5
  Bottom 1.016: JP2.5 81.17,40.5 82.11,41.44 97.53,41.44 98.44,40.52 98.44,5.67 96.89,4.12 C16.1 85.62,2.26 84.88,1.52 77.42,1.52 76.57,2.37 C15.1 75.08,5.39 75.08,8.42 | IC2.8 78.97,13.36 75.08,9.46 75.08,8.42 | 67.94,9.33 JP3.1 69.31,8.42 75.08,8.42 | v5.68,29.93 5.73,29.93 15.77,19.9 v16.43,19.9 | 59.19,41.82 59.34,41.98 | 48.43,38.08 48.43,35.09 JP5.2 48.35,27.16 48.33,27.14 | S3.2 S3.1 | IC2.22 76.43,24.02 78.15,25.74 80.92,25.74 81.21,26.04 81.21,28.3 | 81.21,28.3 81.21,38.08 | 48.43,38.08 54.25,38.08 54.3,38.03 | JP1.2 59.33,38.14 v59.28,38.08 59.23,38.03 | 81.21,28.3 77.06,28.3 74.26,31.1 70.02,31.1 69.97,31.05 | S3.2 47.72,21.12 48.28,21.67 48.28,23.15 | v44.09,42.38 47.62,42.38 48.48,41.51 48.48,38.13 48.43,38.08 | S3.2 43.22,15.15 29.71,15.15 25.01,19.85 v25.09,19.92
  Bottom 1.27: 13.69,37.92 J4.1
N$1
  Bottom 0.152: 73.91,22.36 IC2.23 | 73.91,25.87 JP4.1
  Bottom 1.016: JP4.1 74.03,22.4 IC2.23
N$2
  Bottom 0.152: 71.47,22.36 IC2.24 | 71.47,25.87 JP4.2
  Bottom 1.016: JP4.2 71.49,22.4 IC2.24
N$3
  Bottom 0.152: 68.88,22.36 IC2.25 | 68.88,25.87 JP4.3
  Bottom 1.016: IC2.25 68.81,25.78 JP4.3
N$4
  Bottom 0.152: 66.29,22.36 IC2.26 | 66.29,25.87 JP4.4
  Bottom 1.016: JP4.4 66.41,22.4 IC2.26
N$5
  Bottom 0.152: 63.23,14.59 63.7,14.59 IC2.2
  Bottom 1.016: IC2.2 63.73,13.71 60.55,10.52 JP3.4
N$6  (via drill 0.65)
  Top 1.016: R5.1 20.95,31.66 | 20.95,31.66 21.1,31.81 | 20.95,31.66 v25.39,31.66 | v38.41,31.69 37.18,32.93 IC1.8
  Bottom 1.016: v25.39,31.66 38.27,31.66 38.32,31.61 v38.41,31.69
N$7
  Top 0.61: 29.56,33.96 IC1.11
  Top 1.016: R4.1 26.05,29.02 29.56,32.52 IC1.11
N$8
  Bottom 0.152: 86.56,14.59 IC2.11
  Bottom 1.016: 86.61,14.63 IC2.11 | JP8.1 86.56,11.59 86.56,14.59
N$9
  Bottom 0.152: 89.15,14.59 IC2.12
  Bottom 1.016: 89.15,14.63 IC2.12 89.13,12.85 90.16,11.82 JP8.2
N$10
  Bottom 0.152: 91.74,14.59 IC2.13
  Bottom 1.016: IC2.13 91.69,14.63 91.69,13.17 92.7,12.15 JP8.3
N$11
  Bottom 1.016: IC2.15 94.21,24.99 JP6.1
N$12
  Bottom 1.016: JP8.4 95.24,12.35 94.21,13.38 IC2.14
N$13
  Bottom 0.152: 84.57,7.27 84.35,7.93 Y1.1 83.43,8.01 | 84.12,14.59 IC2.10
  Bottom 1.016: IC2.10 84.05,8.43 Y1.1 83.08,7.45 C16.2
N$14
  Bottom 0.152: Y1.2 77.79,8.62 | 81.37,14.59 IC2.9
  Bottom 1.016: IC2.9 81.51,10.97 Y1.2 79.11,7.3 C15.2
N$15
  Bottom 0.152: 66.1,14.59 66.13,14.59 IC2.3
  Bottom 1.016: IC2.3 66.27,13.66 63.09,10.47 JP3.3
N$17  (via drill 0.35)
  Top 0.61: R3.1 34.98,17.48 v34.46,17.48 | v28.11,24.8 30.39,24.8 Q1.1
  Bottom 0.61: v34.46,17.48 32.38,17.48 28.01,21.85 28.01,24.7 v28.11,24.8
N$19
  Top 1.016: R9.1 22.54,9.18 LED4.A
N$20
  Top 0.61: R1.2 12.92,20.44 12.92,24.62 13.89,25.59 15.48,25.59 Q2.1
N$21
  Top 1.016: 29.2,6.19 J3.1
  Top 2.54: J3.1 26.53,3.51 17.78,3.51 J5.2 14.02,6.59 9.72,2.29 6.83,2.29 2.29,6.83 2.29,32.49 8.28,38.49 J4.2
N$22
  Top 1.016: R7.1 19.92,17.91 LED2.A
N$23
  Top 1.016: LED1.A 13.17,31.61 R6.1
N$24
  Top 1.016: R8.1 12.73,13.3 13.58,12.45 LED3.A
N$25  (1 unrouted)
  Top 1.016: 8.45,21.19 Q4.2 9.32,18.03 R1.1 14.48,17.18 14.48,15.07
  Top 2.54: Q4.2 9.02,18.33 | 8.17,18.62 Q4.2 | Q4.2 8.45,7.85 J5.1
N$29  (via drill 1)  (2 unrouted)
  Top 1.016: 29.71,13.83 29.71,14.74 Q3.2 25.01,11.01 R9.2 | R3.2 36.28,12.33 v34.05,12.33
  Top 2.54: Q3.2 33.37,15.22 34.28,12.78 | 34.28,12.23 34.23,12.17 34.23,6.24 J3.2
N$33  (via drill 0.65)
  other vias: 41.19,42.4
N$34  (via drill 0.65)
  other vias: 40.43,36.74
N$35  (via drill 0.65)
  other vias: 41.65,1.61
N$36  (via drill 0.65)
  other vias: 41.83,5.14
N$37  (via drill 0.65)
  other vias: 42.16,7.25
N$38  (via drill 0.65)
  other vias: 45.28,20.86
N$39  (via drill 0.65)
  other vias: 43.2,29.29
N$41  (via drill 1)
  other vias: 24.58,3.77
N$42  (via drill 1)
  other vias: 18.59,3.69
N$43  (via drill 1)
  other vias: 3.6,5.27
N$44  (via drill 1)
  other vias: 8.25,12.68
N$45  (via drill 1)
  other vias: 3.98,33.79
N$46  (via drill 1)
  other vias: 7.28,32.01
RCS
  Bottom 0.152: 91.59,37.91 91.43,38.06 JP2.1 | 91.59,22.36 IC2.16
  Bottom 1.016: IC2.16 91.67,37.86 JP2.1
RESET
  Bottom 0.152: 60.8,15.05 61.11,14.74 IC2.1 | 58.21,15.05 R2.1
  Bottom 1.016: R2.1 58.69,14.64 IC2.1 | 56,12.35 R2.1 | S3.4 S3.3 52.65,12.73 R2.1
RMISO
  Bottom 0.152: 86.71,22.36 IC2.18
  Bottom 1.016: IC2.18 86.59,30.53 88.79,32.73 JP2.2
RMOSI  (via drill 1)  (2 unrouted)
  Top 1.016: v89.12,29.35 86.12,32.34 v86.12,34.88
  Bottom 0.152: 89.15,22.36 IC2.17 | 86.4,38.21 86.27,38.2 JP2.3
  Bottom 1.016: 86.07,34.76 86.07,38 86.27,38.2 | 89.12,29.29 89.13,29.28 IC2.17
RPARACHUTE  (via drill 0.65)
  Top 0.61: 33.83,29.85 33.9,29.85 | v70.1,10.85 v70.1,6.08 70.1,6.03 | 33.9,29.85 33.9,31.25 32.1,33.05 IC1.10 32.4,35.06 | 33.9,29.85 33.9,22.06 36.14,19.82 37.31,19.82 40.28,16.85 40.28,6.56 41.65,5.19 46.88,5.19 v47.03,5.04
  Bottom 0.61: IC2.4 68.81,12.14 v70.1,10.85 70.12,10.83 | v70.1,6.08 69.06,5.04 v47.03,5.04
  Bottom 1.016: IC1.12 27.02,37.12 27.42,37.52 31.64,37.52 32.1,37.07 IC1.10
RSCK
  Bottom 0.152: 83.97,37.91 83.81,38.06 JP2.4 | 83.97,22.36 IC2.19
  Bottom 1.016: JP2.4 84.05,37.86 IC2.19
RSCL
  Bottom 0.152: 61.26,41.26 61.87,41.87 JP1.3 | 61.26,22.36 IC2.28
  Bottom 1.016: JP1.3 61.87,29.91 61.19,29.23 IC2.28
RSDA
  Bottom 0.152: 63.85,41.41 64.31,41.87 JP1.4 | 63.85,22.36 IC2.27
  Bottom 1.016: JP1.4 64.41,28.82 63.73,28.14 IC2.27
SINAL1  (via drill 0.65)
  Top 0.61: 39.22,25.03 Q1.4 40.12,24.85 42.72,22.26 42.72,9.23 v42.94,9.23 46.73,9.23 v47.01,8.95 | v71.67,10.75 v71.67,5.27
  Bottom 0.61: IC2.5 71.67,14.32 v71.67,10.75 | v71.67,5.27 69.87,3.46 46.02,3.46 45.33,4.15 45.33,8.34 45.94,8.95 46.73,8.95 | v47.01,8.95 47.06,8.95
  Bottom 1.016: 46.73,8.95 v47.01,8.95
SINAL2  (via drill 0.65)
  Top 0.61: Q2.4 26.04,27.44 30.63,27.44 32.45,25.61 32.45,21.62 35.68,18.4 36.82,18.4 39.41,15.81 39.41,2.68 40.38,1.71 46.62,1.71 v46.63,1.72 | v73.36,10.79 v73.36,4.42
  Bottom 0.152: IC2.6
  Bottom 0.61: IC2.6 73.89,11.32 v73.36,10.79 73.27,10.7 | v73.36,4.42 70.86,1.91 46.82,1.91 v46.63,1.72
SKIB1
  Top 1.016: R13.1 22.42,17.52 Q3.1 21.82,18.33 R7.2 21.82,21.51 20.39,22.94 20.39,27.95 21.46,29.02 R4.2
SKIB2
  Top 1.016: Q4.1 10.75,27.67 R14.1 13.89,29.14 15.23,30.49 15.23,31.49 R6.2 17.58,31.63 R5.2
TPARACHUTE  (via drill 0.65)
  Top 0.61: 36.24,24.77 36.33,24.86 | IC1.9 34.64,32.83 36.33,31.14 36.33,24.86 | 36.33,24.86 36.33,21.81 37.31,20.84 38.3,20.84 41.78,17.36 41.78,7.2 42,6.97 46.96,6.97 v47.05,7.06
  Bottom 0.61: JP3.2 65.63,7.2 65.02,6.59 58.72,6.59 57.87,7.44 47.43,7.44 v47.05,7.06
  Bottom 1.016: IC1.13 24.48,38.67 25.6,39.78 33.37,39.78 34.64,38.51 IC1.9
VCC  (via drill 0.35, 0.65)
  Top 0.61: Q2.3 v26.05,23
  Top 1.016: IC1.14 21.94,37.5 23.61,39.18 37.48,39.18 40.02,36.64 43.1,36.64 v43.27,36.46 | Q1.3 39.26,22.31 v40.76,20.81 | v28.57,29.12 31.69,29.12 31.72,29.14 v32.23,29.14
  Bottom 0.152: 76.5,14.74 IC2.7 | 81.37,22.21 IC2.20 | 56.69,41.87 56.76,41.96 JP1.1 56.84,42.02
  Bottom 0.61: JP5.1 45.81,34.7 | IC2.20 81.51,23.08 | v26.05,23 26.05,26.55 28.59,29.09
  Bottom 1.016: IC2.7 76.43,16.56 77.87,17.99 | IC2.20 81.51,19.43 80.74,18.65 78.53,18.65 77.87,17.99 | R2.2 61.28,17.99 77.87,17.99 | 56.38,41.57 56.76,41.96 | 45.81,34.7 46.02,34.91 44.47,36.46 v43.27,36.46 | 45.61,35.21 JP5.1 45.15,34.35 45.15,28.94 | R2.2 59.23,25.74 59.23,33.28 56.84,35.67 56.84,42.02 | R2.2 54.48,22.89 52.37,25 46.2,25 | 46.2,25 45.15,26.04 45.15,28.94 | v40.76,20.81 45.18,20.81 46.2,21.83 46.2,25 | 28.59,29.09 v28.57,29.12 | v32.23,29.14 44.95,29.14 45.15,28.94